# EAGLE design BazzFussTrueBypass (EAGLE 7.1.0)
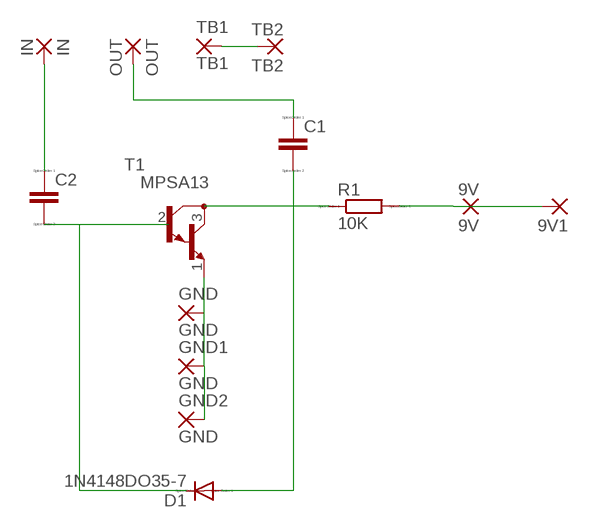
[diagram p0: schematic, sheet 1]

## Parts
9V  9V  1,6/0,8  [1,6/0,8]
9V1  1,6/0,8  [1,6/0,8]
C1  C-EU025-025X050  [C025-025X050]
C2  C-EU025-025X050  [C025-025X050]
D1  1N4148DO35-7  [DO35-7]
GND  GND  1,6/0,8  [1,6/0,8]
GND1  GND  1,6/0,8  [1,6/0,8]
GND2  GND  1,6/0,8  [1,6/0,8]
IN  IN  1,6/0,8  [1,6/0,8]
OUT  OUT  1,6/0,8  [1,6/0,8]
R1  10K  R0207/10  [0207/10]
T1  MPSA13  BC517  [TO92]
TB1  TB1  1,6/0,8  [1,6/0,8]
TB2  TB2  1,6/0,8  [1,6/0,8]

## Nets
1N4148: C1.2 D1.A R1.1 T1.3(C)
9V: 9V1.1(P) 9V.1(P) R1.2
GND: GND1.1(P) GND2.1(P) GND.1(P) T1.1(E)
IN: C2.1 IN.1(P)
N$1: TB1.1(P) TB2.1(P)
N$2: C2.2 D1.C T1.2(B)
OUT: C1.1 OUT.1(P)

## Library data of the parts
9V 9V1 GND GND1 GND2 IN OUT TB1 TB2 = wirepad:1,6/0,8: THROUGH-HOLE PAD
C1 C2 = resistor:C-EU: CAPACITOR, European symbol; SPICEPREFIX: C
D1 = diode:1N4148: DIODE high speed (Philips)
R1 = eagle-ltspice:R: RESISTOR, European symbol; SPICEMODEL: NONE; SPICEPREFIX: R
T1 = transistor:BC517: NPN BIPOLAR DARLINGTON TRANSISTOR

## Board
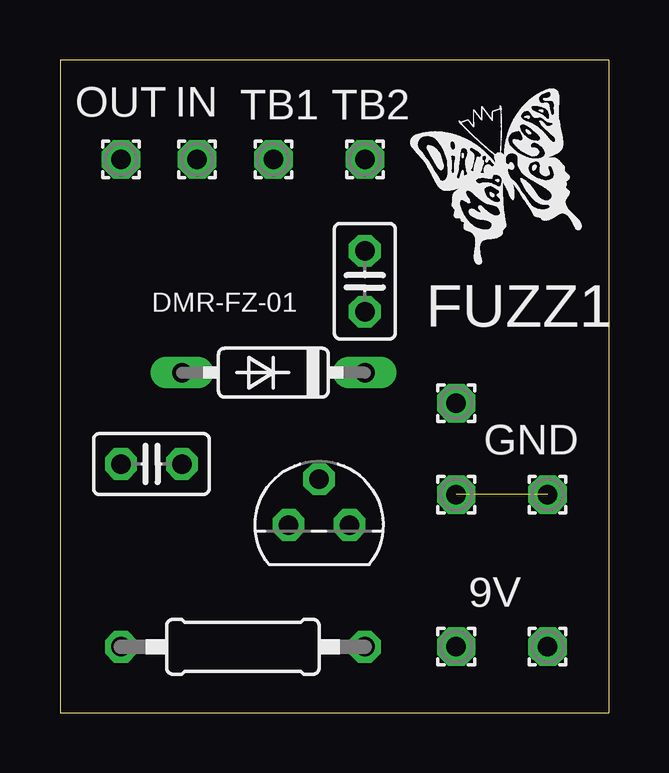
[diagram p1: board, top side]
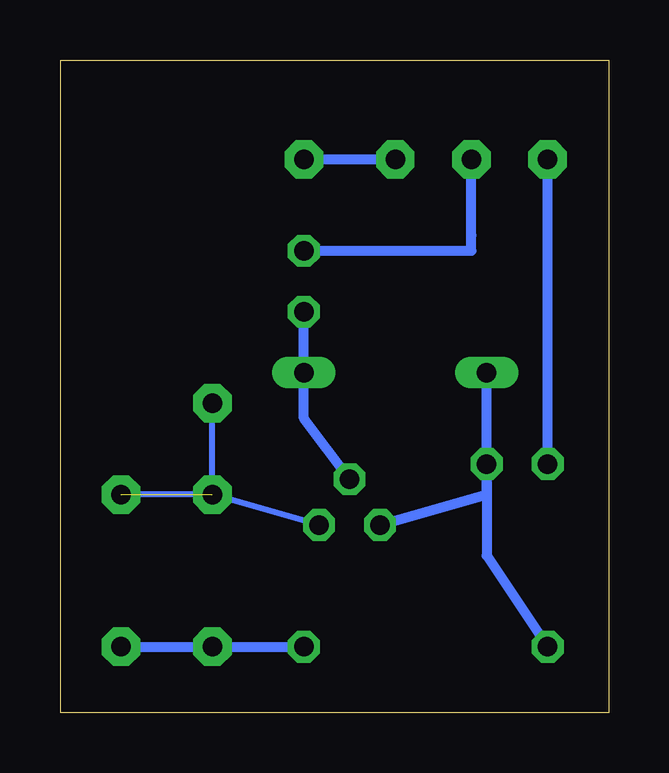
[diagram p2: board, bottom side, seen from below]

Size 22.86 x 27.21 mm. Coordinates in mm from the lower left corner, seen from the top.
Outline: 0,0 22.86,0 22.86,27.21 0,27.21 0,0
Copper layers (1*16): Top 0.035mm / dielectric 1.5mm / Bottom 0.035mm
Design rules "hackvana": minimum track width 6mil, minimum drill 0.3mm, track to track 6mil, track to pad 6mil, pad to pad 6mil, via to via 6mil, smd to smd 0mil, copper to edge 6mil, drill to drill 6mil, minimum pad ring 10mil, minimum via ring 6mil, stop-mask expansion 2mil, vias tented up to drill 100mil, thermal gap 10mil

### Footprints (pad centres in the part's own frame; a part is rotated, then mirrored left to right if it is on the bottom)
1,6/0,8 = drill 0.813 pad 1.6 octagon: 1 0,0
C025-025X050 = drill 0.813 octagon: 1 -1.27,0; 2 1.27,0
DO35-7 = drill 0.813 long: A 3.81,0; C -3.81,0
0207/10 = drill 0.813 octagon: 1 -5.08,0; 2 5.08,0
TO92 = drill 0.813 octagon: 1 1.27,0; 2 0,1.905; 3 -1.27,0

### Placement (x,y rotation side)
9V  16.51,2.74 0 top
9V1  20.32,2.74 0 top
C1  3.81,10.36 0 top
C2  12.7,17.98 270 top
D1  8.89,14.17 180 top
GND  20.32,9.09 0 top
GND1  16.51,9.09 0 top
GND2  16.51,12.9 0 top
IN  5.71,23.06 0 top
OUT  2.54,23.06 0 top
R1  7.62,2.74 0 top
T1  10.79,7.82 0 top
TB1  8.89,23.06 0 top
TB2  12.7,23.06 0 top

### Tracks (layer width: path | path; a pad name or v marks a point on that pad's centre or on a via)
1N4148
  Bottom 0.406: C1.2 D1.A | C1.2 5.08,6.55 R1.1 | T1.3 5.08,9.09 C1.2
9V
  Bottom 0.406: R1.2 9V.1 9V1.1
GND  (1 unrouted)
  Bottom 0.254: T1.1 GND1.1 | GND1.1 GND.1 | GND1.1 GND2.1
IN
  Bottom 0.406: C2.1 5.71,19.25 5.71,19.89 IN.1
N$1
  Bottom 0.406: TB1.1 TB2.1
N$2
  Bottom 0.406: T1.2 12.7,12.27 D1.C C2.2
OUT
  Bottom 0.406: C1.1 OUT.1

### Text on the board
tPlace: DMR-FZ-01
tNames: FUZZ1